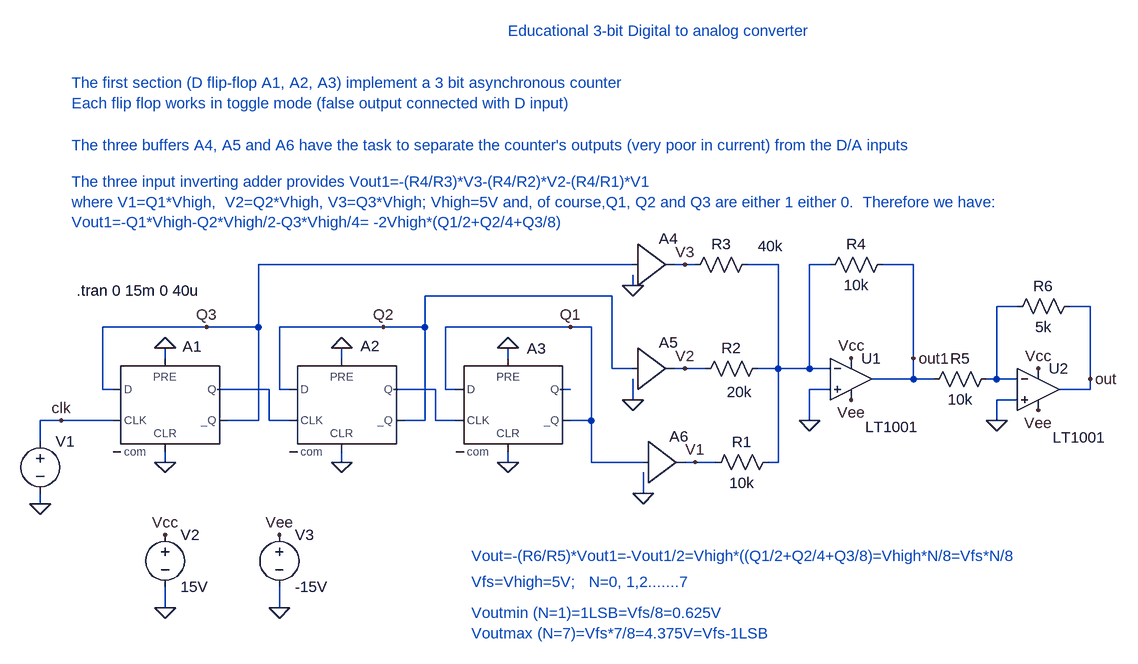
[diagram p0: schematic dac.asc]
dac.asc, the LTspice schematic file:
Version 4
SHEET 1 2348 680
WIRE -80 256 -80 224
WIRE -80 352 -80 336
WIRE -48 224 -80 224
WIRE 16 176 16 80
WIRE 32 176 16 176
WIRE 32 224 -48 224
WIRE 112 128 112 112
WIRE 112 288 112 272
WIRE 112 512 112 480
WIRE 176 80 16 80
WIRE 256 80 176 80
WIRE 256 80 256 -16
WIRE 256 224 208 224
WIRE 256 224 256 80
WIRE 272 176 192 176
WIRE 272 224 272 176
WIRE 288 176 288 80
WIRE 288 512 288 480
WIRE 304 176 288 176
WIRE 304 224 272 224
WIRE 384 128 384 112
WIRE 384 288 384 272
WIRE 448 80 288 80
WIRE 512 80 448 80
WIRE 512 80 512 32
WIRE 512 224 480 224
WIRE 512 224 512 80
WIRE 528 176 464 176
WIRE 528 224 528 176
WIRE 544 176 544 80
WIRE 560 176 544 176
WIRE 560 224 528 224
WIRE 640 128 640 112
WIRE 640 288 640 272
WIRE 736 80 544 80
WIRE 736 176 720 176
WIRE 768 80 736 80
WIRE 768 224 736 224
WIRE 768 224 768 80
WIRE 768 288 768 224
WIRE 800 32 512 32
WIRE 800 144 800 32
WIRE 832 -16 256 -16
WIRE 832 16 832 0
WIRE 832 144 800 144
WIRE 832 192 832 160
WIRE 848 288 768 288
WIRE 848 336 848 304
WIRE 912 -16 896 -16
WIRE 912 144 896 144
WIRE 928 -16 912 -16
WIRE 928 288 912 288
WIRE 944 144 912 144
WIRE 960 288 928 288
WIRE 1056 -16 1008 -16
WIRE 1056 144 1024 144
WIRE 1056 144 1056 -16
WIRE 1056 288 1040 288
WIRE 1056 288 1056 144
WIRE 1104 144 1056 144
WIRE 1104 144 1104 -16
WIRE 1104 224 1104 176
WIRE 1136 -16 1104 -16
WIRE 1136 144 1104 144
WIRE 1136 176 1104 176
WIRE 1264 -16 1216 -16
WIRE 1264 128 1264 -16
WIRE 1264 160 1200 160
WIRE 1264 160 1264 128
WIRE 1296 160 1264 160
WIRE 1392 160 1376 160
WIRE 1392 160 1392 48
WIRE 1392 224 1392 192
WIRE 1424 48 1392 48
WIRE 1424 160 1392 160
WIRE 1424 192 1392 192
WIRE 1536 48 1504 48
WIRE 1536 160 1536 48
WIRE 1536 176 1488 176
WIRE 1536 176 1536 160
FLAG -80 352 0
FLAG -48 224 clk
FLAG 176 80 Q3
FLAG 736 80 Q1
FLAG 112 288 0
FLAG 384 288 0
FLAG 640 288 0
FLAG 112 112 0
FLAG 384 112 0
FLAG 640 112 0
FLAG 1104 224 0
FLAG 112 512 0
FLAG 288 512 0
FLAG 112 400 Vcc
FLAG 1168 128 Vcc
FLAG 288 400 Vee
FLAG 1168 192 Vee
FLAG 1264 128 out1
FLAG 448 80 Q2
FLAG 912 -16 V3
FLAG 912 144 V2
FLAG 928 288 V1
FLAG 832 16 0
FLAG 832 192 0
FLAG 848 336 0
FLAG 1392 224 0
FLAG 1456 144 Vcc
FLAG 1456 208 Vee
FLAG 1536 160 out
SYMBOL Digital\\dflop 112 128 R0
WINDOW 0 27 -18 Left 0
WINDOW 3 0 0 Invisible 0
SYMATTR InstName A1
SYMATTR Value Ref=2.5
SYMATTR Value2 Vhigh=5V; Vlow=0
SYMATTR SpiceLine Td=20n   Trise=10n Tfall=10n
SYMATTR SpiceLine2 tripdt=5n
SYMBOL voltage -80 240 R0
WINDOW 3 24 104 Invisible 0
WINDOW 123 0 0 Left 0
WINDOW 39 0 0 Left 0
SYMATTR Value PULSE(5V 0 100n 1n 1n 0.5m 1m 15)
SYMATTR InstName V1
SYMBOL Digital\\dflop 384 128 R0
WINDOW 0 29 -19 Left 0
WINDOW 3 0 0 Invisible 0
SYMATTR InstName A2
SYMATTR Value Ref=2.5
SYMATTR Value2 Vhigh=5V; Vlow=0
SYMATTR SpiceLine Td=20n   Trise=10n Tfall=10n
SYMATTR SpiceLine2 tripdt=5n
SYMBOL Digital\\dflop 640 128 R0
WINDOW 0 29 -15 Left 0
WINDOW 3 0 0 Invisible 0
SYMATTR InstName A3
SYMATTR Value Ref=2.5
SYMATTR Value2 Vhigh=5V; Vlow=0
SYMATTR SpiceLine Td=20n   Trise=10n Tfall=10n
SYMATTR SpiceLine2 tripdt=5n
SYMBOL Opamps\\LT1001 1168 96 R0
WINDOW 3 22 138 Left 0
SYMATTR InstName U1
SYMBOL res 1024 -32 R90
WINDOW 0 0 56 VBottom 0
WINDOW 3 -28 -20 VTop 0
SYMATTR InstName R3
SYMATTR Value 40k
SYMBOL res 1040 128 R90
WINDOW 0 0 56 VBottom 0
WINDOW 3 36 44 VTop 0
SYMATTR InstName R2
SYMATTR Value 20k
SYMBOL res 1056 272 R90
WINDOW 0 0 56 VBottom 0
WINDOW 3 32 56 VTop 0
SYMATTR InstName R1
SYMATTR Value 10k
SYMBOL res 1232 -32 R90
WINDOW 0 0 56 VBottom 0
WINDOW 3 32 56 VTop 0
SYMATTR InstName R4
SYMATTR Value 10k
SYMBOL voltage 112 384 R0
SYMATTR InstName V2
SYMATTR Value 15V
SYMBOL voltage 288 384 R0
SYMATTR InstName V3
SYMATTR Value -15V
SYMBOL Opamps\\LT1001 1456 112 R0
WINDOW 3 22 138 Left 0
SYMATTR InstName U2
SYMBOL res 1392 144 R90
WINDOW 0 0 56 VBottom 0
WINDOW 3 32 56 VTop 0
SYMATTR InstName R5
SYMATTR Value 10k
SYMBOL res 1520 32 R90
WINDOW 0 0 56 VBottom 0
WINDOW 3 32 56 VTop 0
SYMATTR InstName R6
SYMATTR Value 5k
SYMBOL Digital\\buf1 832 -80 R0
SYMATTR InstName A4
SYMATTR Value2 Vhigh=5  Vlow=0
SYMATTR SpiceLine td=10n
SYMBOL Digital\\buf1 832 80 R0
SYMATTR InstName A5
SYMATTR Value2 Vhigh=5  Vlow=0
SYMATTR SpiceLine td=10n
SYMBOL Digital\\buf1 848 224 R0
SYMATTR InstName A6
SYMATTR Value2 Vhigh=5  Vlow=0
SYMATTR SpiceLine td=10n
TEXT -24 24 Left 0 !.tran 0 15m 0 40u
TEXT -32 -296 Left 0 ;The first section (D flip-flop A1, A2, A3) implement a 3 bit asynchronous counter\nEach flip flop works in toggle mode (false output connected with D input)
TEXT 640 -376 Left 0 ;Educational 3-bit Digital to analog converter
TEXT -32 -200 Left 0 ;The three buffers A4, A5 and A6 have the task to separate the counter's outputs (very poor in current) from the D/A inputs
TEXT -32 -144 Left 0 ;The three input inverting adder provides Vout1=-(R4/R3)*V3-(R4/R2)*V2-(R4/R1)*V1\nwhere V1=Q1*Vhigh,  V2=Q2*Vhigh, V3=Q3*Vhigh; Vhigh=5V and, of course,Q1, Q2 and Q3 are either 1 either 0.  Therefore we have:\nVout1=-Q1*Vhigh-Q2*Vhigh/2-Q3*Vhigh/4= -2Vhigh*(Q1/2+Q2/4+Q3/8)
TEXT 584 432 Left 0 ;Vout=-(R6/R5)*Vout1=-Vout1/2=Vhigh*((Q1/2+Q2/4+Q3/8)=Vhigh*N/8=Vfs*N/8
TEXT 584 520 Left 0 ;Voutmin (N=1)=1LSB=Vfs/8=0.625V\nVoutmax (N=7)=Vfs*7/8=4.375V=Vfs-1LSB
TEXT 584 472 Left 0 ;Vfs=Vhigh=5V;   N=0, 1,2.......7

The netlist it stands for:
* dac.asc
A1 Q3 0 clk 0 0 Q3 N001 0 DFLOP Ref=2.5 Vhigh=5V; Vlow=0 Td=20n   Trise=10n Tfall=10n tripdt=5n
V1 clk 0 PULSE(5V 0 100n 1n 1n 0.5m 1m 15)
A2 Q2 0 N001 0 0 Q2 N002 0 DFLOP Ref=2.5 Vhigh=5V; Vlow=0 Td=20n   Trise=10n Tfall=10n tripdt=5n
A3 Q1 0 N002 0 0 Q1 N003 0 DFLOP Ref=2.5 Vhigh=5V; Vlow=0 Td=20n   Trise=10n Tfall=10n tripdt=5n
XU1 0 N004 Vcc Vee out1 LT1001  ; pins In+ In- V+ V- OUT
R3 N004 V3 40k
R2 N004 V2 20k
R1 N004 V1 10k
R4 out1 N004 10k
V2 Vcc 0 15V
V3 Vee 0 -15V
XU2 0 N005 Vcc Vee out LT1001  ; pins In+ In- V+ V- OUT
R5 N005 out1 10k
R6 out N005 5k
A4 Q3 0 0 0 0 0 V3 0 BUF Vhigh=5  Vlow=0 td=10n
A5 Q2 0 0 0 0 0 V2 0 BUF Vhigh=5  Vlow=0 td=10n
A6 Q1 0 0 0 0 0 V1 0 BUF Vhigh=5  Vlow=0 td=10n
.tran 0 15m 0 40u
* The first section (D flip-flop A1, A2, A3) implement a 3 bit asynchronous counter
* Each flip flop works in toggle mode (false output connected with D input)
* Educational 3-bit Digital to analog converter
* The three buffers A4, A5 and A6 have the task to separate the counter's outputs (very poor in current) from the D/A inputs
* The three input inverting adder provides Vout1=-(R4/R3)*V3-(R4/R2)*V2-(R4/R1)*V1
* where V1=Q1*Vhigh,  V2=Q2*Vhigh, V3=Q3*Vhigh; Vhigh=5V and, of course,Q1, Q2 and Q3 are either 1 either 0.  Therefore we have:
* Vout1=-Q1*Vhigh-Q2*Vhigh/2-Q3*Vhigh/4= -2Vhigh*(Q1/2+Q2/4+Q3/8)
* Vout=-(R6/R5)*Vout1=-Vout1/2=Vhigh*((Q1/2+Q2/4+Q3/8)=Vhigh*N/8=Vfs*N/8
* Voutmin (N=1)=1LSB=Vfs/8=0.625V
* Voutmax (N=7)=Vfs*7/8=4.375V=Vfs-1LSB
* Vfs=Vhigh=5V;   N=0, 1,2.......7
.lib LTC.lib
.backanno
.end